# EAGLE schematic RTC (EAGLE 9.0.0)
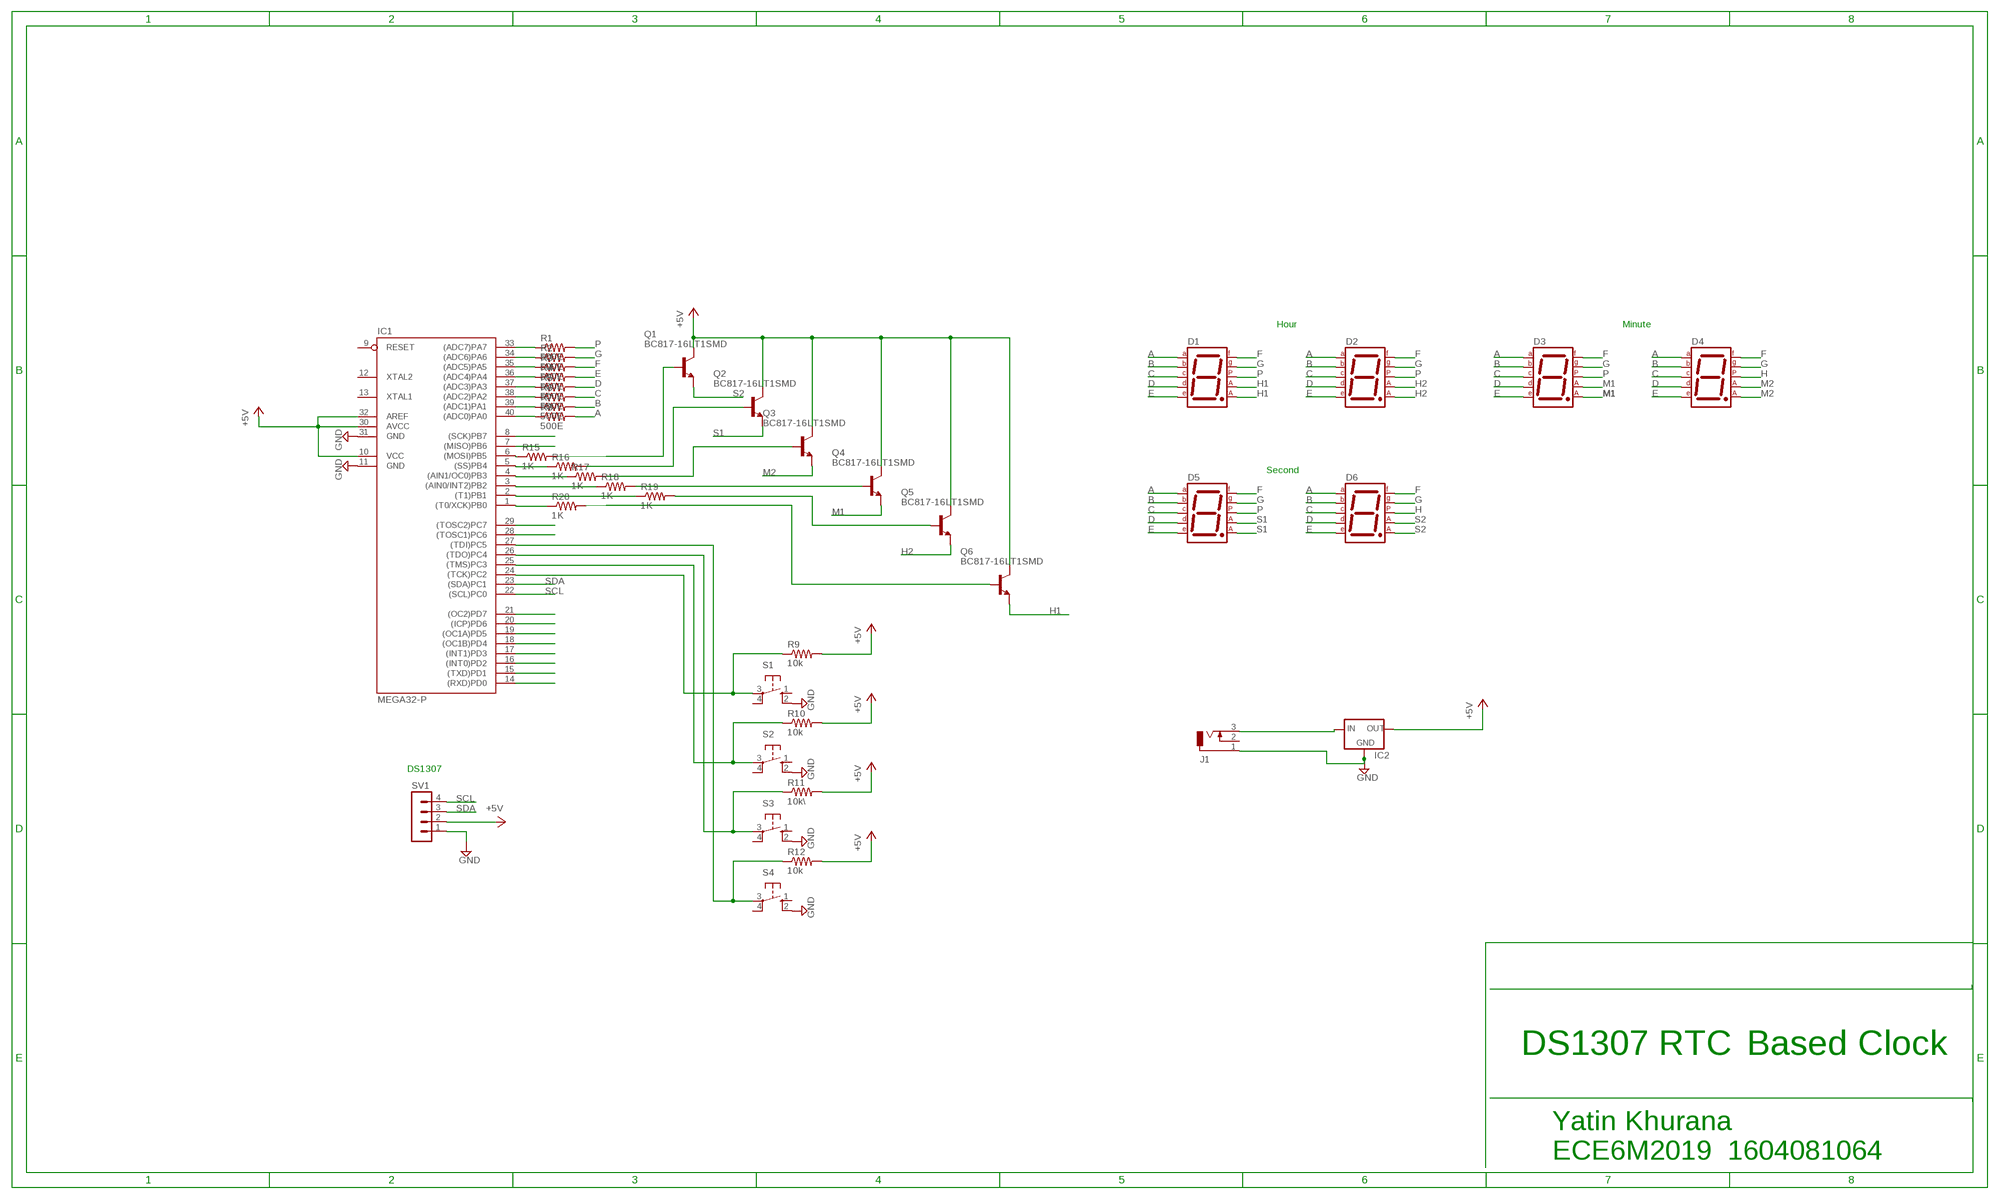
[diagram p0: schematic, sheet 1]

## Parts
D1  7SEG-CA  [7SEG-13]
D2  7SEG-CA  [7SEG-13]
D3  7SEG-CA  [7SEG-13]
D4  7SEG-CA  [7SEG-13]
D5  7SEG-CA  [7SEG-13]
D6  7SEG-CA  [7SEG-13]
IC1  MEGA32-P  [DIL40]
IC2  78XXS  [78XXS]
J1  DCJ0303  [DCJ0303]
Q1  BC817-16LT1SMD  [SOT23-BEC]
Q2  BC817-16LT1SMD  [SOT23-BEC]
Q3  BC817-16LT1SMD  [SOT23-BEC]
Q4  BC817-16LT1SMD  [SOT23-BEC]
Q5  BC817-16LT1SMD  [SOT23-BEC]
Q6  BC817-16LT1SMD  [SOT23-BEC]
R1  500E  R-US_M1206  [M1206]
R2  500E  R-US_M1206  [M1206]
R3  500E  R-US_M1206  [M1206]
R4  500E  R-US_M1206  [M1206]
R5  500E  R-US_M1206  [M1206]
R6  500E  R-US_M1206  [M1206]
R7  500E  R-US_M1206  [M1206]
R8  500E  R-US_M1206  [M1206]
R9  10k  R-US_M1206  [M1206]
R10  10k  R-US_M1206  [M1206]
R11  10k\  R-US_M1206  [M1206]
R12  10k  R-US_M1206  [M1206]
R15  1K  R-US_M1206  [M1206]
R16  1K  R-US_M1206  [M1206]
R17  1K  R-US_M1206  [M1206]
R18  1K  R-US_M1206  [M1206]
R19  1K  R-US_M1206  [M1206]
R20  1K  R-US_M1206  [M1206]
S1  10-XX  [B3F-10XX]
S2  10-XX  [B3F-10XX]
S3  10-XX  [B3F-10XX]
S4  10-XX  [B3F-10XX]
SV1  MA04-1  [MA04-1]

## Nets
+5V: IC1.10(VCC) IC1.30(AVCC) IC1.32(AREF) IC2.OUT Q1.C Q2.C Q3.C Q4.C Q5.C Q6.C R9.2 R10.2 R11.2 R12.2 SV1.2
A: D1.7(A) D2.7(A) D3.7(A) D4.7(A) D5.7(A) D6.7(A) R8.2
B: D1.6(B) D2.6(B) D3.6(B) D4.6(B) D5.6(B) D6.6(B) R7.2
C: D1.4(C) D2.4(C) D3.4(C) D4.4(C) D5.4(C) D6.4(C) R6.2
D: D1.2(D) D2.2(D) D3.2(D) D4.2(D) D5.2(D) D6.2(D) R5.2
E: D1.1(E) D2.1(E) D3.1(E) D4.1(E) D5.1(E) D6.1(E) R4.2
F: D1.9(F) D2.9(F) D3.9(F) D4.9(F) D5.9(F) D6.9(F) R3.2
G: D1.10(G) D2.10(G) D3.10(G) D4.10(G) D5.10(G) D6.10(G) R2.2
GND: IC1.11(GND) IC1.31(GND) IC2.GND J1.1 S1.2(S1) S2.2(S1) S3.2(S1) S4.2(S1) SV1.1
H: D4.5(DP) D6.5(DP)
H1: D1.3(CA1) D1.8(CA2) Q6.E
H2: D2.3(CA1) D2.8(CA2) Q5.E
M1: D3.3(CA1) D3.8(CA2) Q4.E
M2: D4.3(CA1) D4.8(CA2) Q3.E
N$1: IC2.IN J1.3
N$5: IC1.6((MOSI)PB5) R15.1
N$6: IC1.5((SS)PB4) R16.1
N$7: IC1.4((AIN1/OC0)PB3) R17.1
N$8: IC1.3((AIN0/INT2)PB2) R18.1
N$9: IC1.2((T1)PB1) R19.1
N$10: IC1.1((T0/XCK)PB0) R20.1
N$11: Q4.B R18.2
N$121: IC1.33((ADC7)PA7) R1.1
N$122: IC1.34((ADC6)PA6) R2.1
N$123: IC1.35((ADC5)PA5) R3.1
N$124: IC1.36((ADC4)PA4) R4.1
N$125: IC1.37((ADC3)PA3) R5.1
N$126: IC1.8((SCK)PB7)
N$127: IC1.7((MISO)PB6)
N$128: Q1.B R15.2
N$129: Q2.B R16.2
N$130: Q3.B R17.2
N$131: IC1.29((TOSC2)PC7)
N$132: IC1.28((TOSC1)PC6)
N$133: IC1.27((TDI)PC5) R12.1 S4.3(P)
N$134: IC1.26((TDO)PC4) R11.1 S3.3(P)
N$135: IC1.25((TMS)PC3) R10.1 S2.3(P)
N$136: IC1.21((OC2)PD7)
N$137: IC1.20((ICP)PD6)
N$138: IC1.19((OC1A)PD5)
N$139: IC1.18((OC1B)PD4)
N$140: IC1.17((INT1)PD3)
N$141: IC1.16((INT0)PD2)
N$142: IC1.15((TXD)PD1)
N$143: IC1.14((RXD)PD0)
N$144: IC1.24((TCK)PC2) R9.1 S1.3(P)
N$148: Q5.B R19.2
N$149: Q6.B R20.2
N$150: IC1.38((ADC2)PA2) R6.1
N$151: IC1.39((ADC1)PA1) R7.1
N$152: IC1.40((ADC0)PA0) R8.1
P: D1.5(DP) D2.5(DP) D3.5(DP) D5.5(DP) R1.2
S1: D5.3(CA1) D5.8(CA2) Q2.E
S2: D6.3(CA1) D6.8(CA2) Q1.E
SCL: IC1.22((SCL)PC0) SV1.4
SDA: IC1.23((SDA)PC1) SV1.3
Unconnected: IC1.9(RESET) IC1.12(XTAL2) IC1.13(XTAL1) J1.2 S1.1(S) S1.4(P1) S2.1(S) S2.4(P1) S3.1(S) S3.4(P1) S4.1(S) S4.4(P1)

## Notes on the sheet
- Hour | Minute
- Second
- DS1307
- DS1307 RTC | Based Clock
- Yatin Khurana
  ECE6M2019  1604081064

## Library data of the parts
D1-D6 = special:7SEG-CA: 7-segment DISPLAY single anode, 13 mm
IC1 = atmel:MEGA32-P: MICROCONTROLLER 32 Kbytes FLASH 2 Kbytes SRAM 1 Kbytes EEPROM USART 8-channel 10 bit ADC Source: www.atmel.com .. doc2503.pdf; MPN: ATMEGA32-16PU; OC_FARNELL: 1661729; OC_NEWARK: 51P1794
IC2 = v-reg:78XXS: VOLTAGE REGULATOR
J1 = con-jack:DCJ0303: DC POWER JACK Source: DCJ0303.pdf; OC_FARNELL: unknown; OC_NEWARK: unknown
Q1-Q6 = transistor-npn:BC817*: NPN Transistor
R1-R12 R15-R20 = rcl:R-US_: RESISTOR, American symbol; SPICEPREFIX: R
S1-S4 = switch-omron:10-XX: OMRON SWITCH; MPN: B3F-1000; OC_FARNELL: 176432; OC_NEWARK: 36M3542
SV1 = con-lstb:MA04-1: PIN HEADER; OC_FARNELL: unknown; OC_NEWARK: unknown